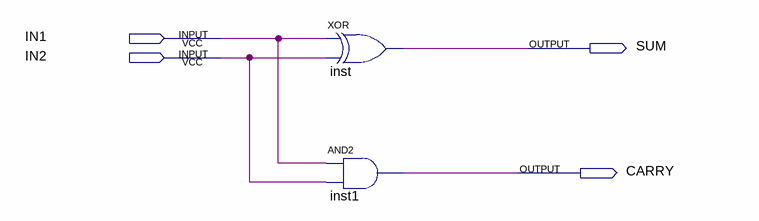
[diagram p0: schematic sheet]
// Quartus schematic Halfadd.bdf as structural Verilog: 2 symbols, 4 pins
module Halfadd (
  input  IN1,
  input  IN2,
  output SUM,
  output CARRY
);

  xor inst (SUM, IN1, IN2);
  and inst1 (CARRY, IN1, IN2);
endmodule
